# Altium schematic sheet Jaw Gripper's Motors Connectors.SchDoc
size A4
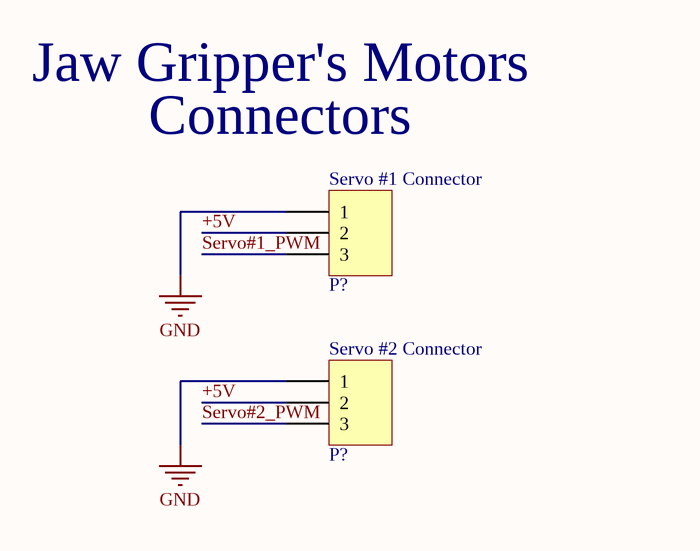
[diagram p0: Jaw Gripper's Motors Connectors.SchDoc]

## Parts
(Parts that share a designator on the sheet are numbered #1, #2 ... from top to bottom, then left to right.)
P?#1  HDR1X3  [Molex SPOX Horizontal 3 Circuits]  (value not drawn)
P?#2  HDR1X3  [Molex SPOX Horizontal 3 Circuits]  (value not drawn)

## Nets
GND: P?#1.1 P?#2.1
+5V: P?#1.2 P?#2.2
Servo#1_PWM: P?#1.3
Servo#2_PWM: P?#2.3

## Notes on the sheet
- Jaw Gripper's Motors
- (near P?#1) Connectors
- (near P?#1) Servo #1 Connector
- (near P?#2) Servo #2 Connector

## Library data of the parts
P?#1 P?#2 = HDR1X3: Header, 3-Pin; LatestRevisionDate: 17-Jul-2002; LatestRevisionNote: Re-released for DXP Platform.; Publisher: Altium Limited